# EAGLE design pic24OLED (EAGLE 9.4.2)
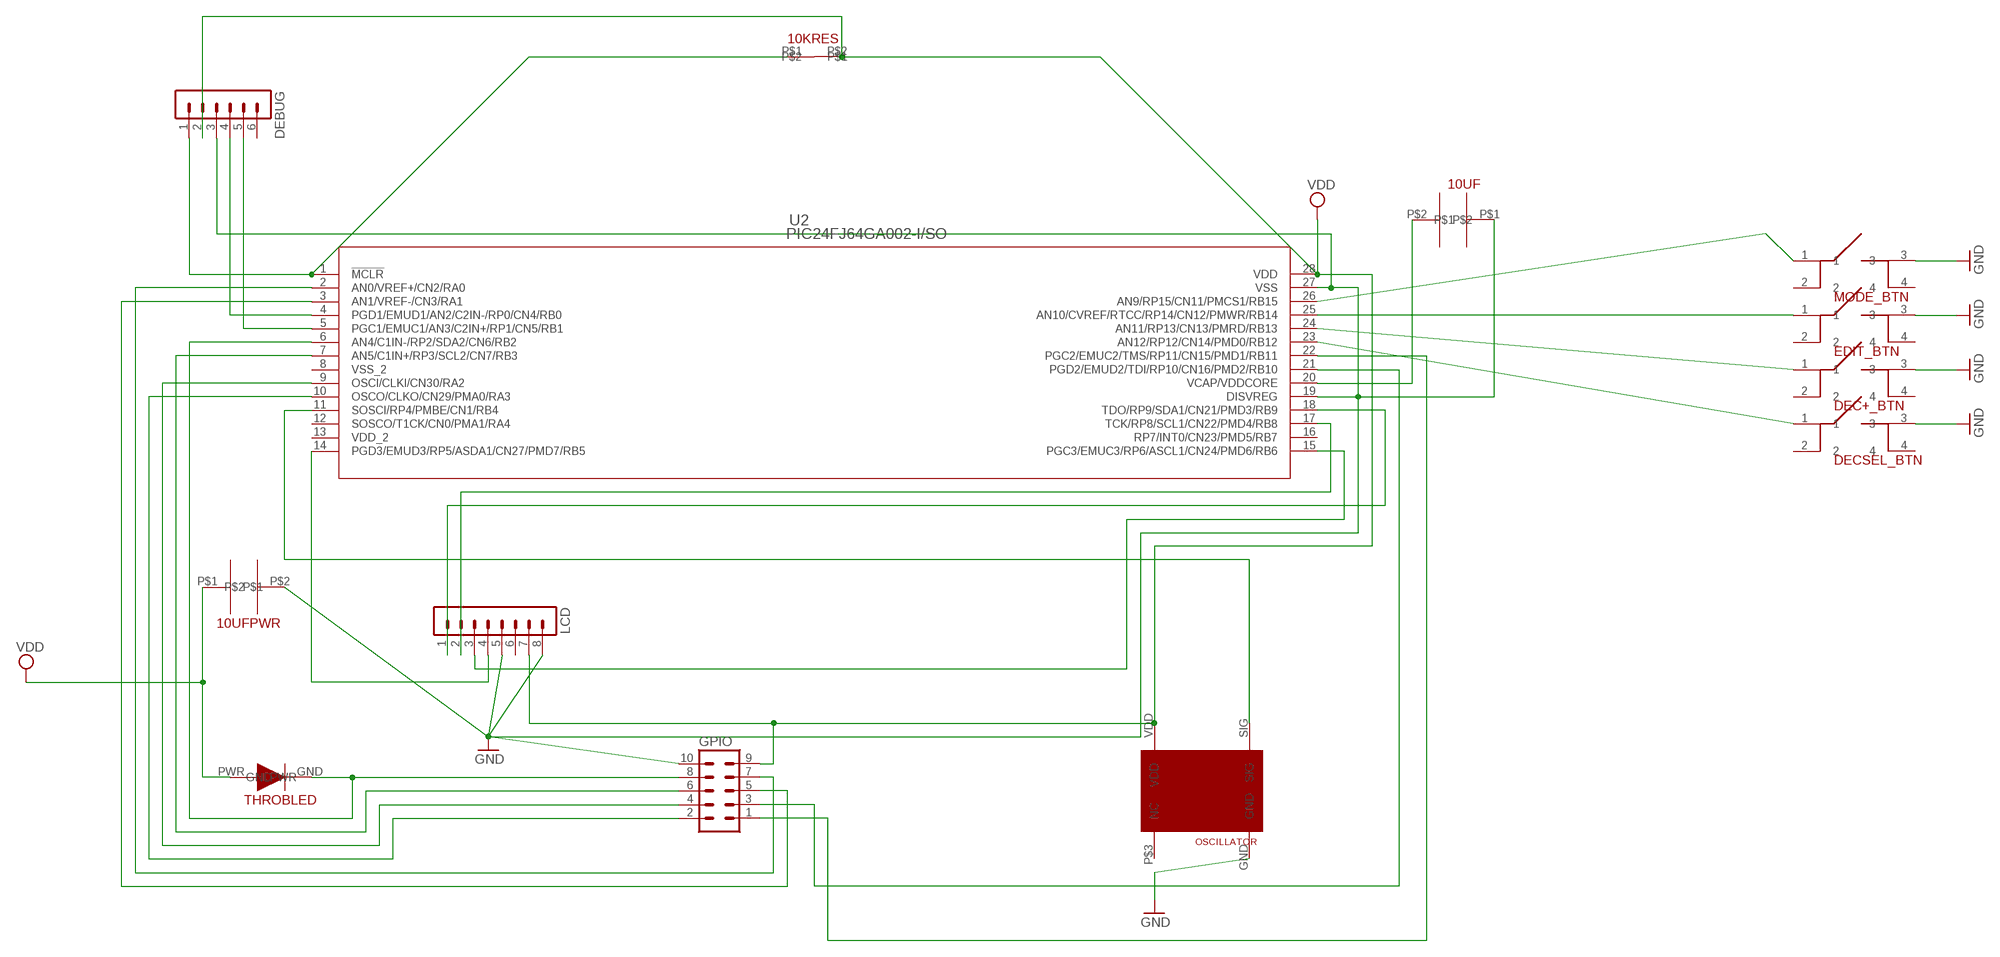
[diagram p0: schematic, sheet 1]

## Parts
10KRES  THRESISTOR  [THRESISTOR]
10UF  THCAP  [THCAP]
10UFPWR  THCAP  [THCAP]
DEBUG  MA06-1  [MA06-1]
DEC+_BTN  PTS645-BUTTONPTS645  [TL3315-BUTTON]
DECSEL_BTN  PTS645-BUTTONPTS645  [TL3315-BUTTON]
EDIT_BTN  PTS645-BUTTONPTS645  [TL3315-BUTTON]
GPIO  MA05-2  [MA05-2]
LCD  MA08-1  [MA08-1]
MODE_BTN  PTS645-BUTTONPTS645  [TL3315-BUTTON]
OSCILLATOR  LX0-32.768OSCILLATOR  [LX0-32.768OSCILLATOR]
THROBLED  THLED  [THLED]
U2  PIC24FJ64GA002-I/SO  [SOIC28-W_MC]

## Nets
GND: 10UF.P$1 10UFPWR.P$2 DEBUG.3 DEC+_BTN.3 DECSEL_BTN.3 EDIT_BTN.3 GPIO.10 LCD.5 LCD.8 MODE_BTN.3 OSCILLATOR.GND U2.19(DISVREG) U2.27(VSS)
N$1: 10KRES.P$1 DEBUG.1 U2.1(!MCLR)
N$2: GPIO.4 U2.9(OSCI/CLKI/CN30/RA2)
N$3: MODE_BTN.1 U2.26(AN9/RP15/CN11/PMCS1/RB15)
N$4: EDIT_BTN.1 U2.25(AN10/CVREF/RTCC/RP14/CN12/PMWR/RB14)
N$5: DEC+_BTN.1 U2.24(AN11/RP13/CN13/PMRD/RB13)
N$6: DECSEL_BTN.1 U2.23(AN12/RP12/CN14/PMD0/RB12)
N$7: LCD.4 U2.14(PGD3/EMUD3/RP5/ASDA1/CN27/PMD7/RB5)
N$8: LCD.3 U2.15(PGC3/EMUC3/RP6/ASCL1/CN24/PMD6/RB6)
N$9: LCD.2 U2.17(TCK/RP8/SCL1/CN22/PMD4/RB8)
N$10: LCD.1 U2.18(TDO/RP9/SDA1/CN21/PMD3/RB9)
N$11: 10UF.P$2 U2.20(VCAP/VDDCORE)
N$12: GPIO.6 U2.7(AN5/C1IN+/RP3/SCL2/CN7/RB3)
N$13: OSCILLATOR.SIG U2.11(SOSCI/RP4/PMBE/CN1/RB4)
N$14: GPIO.8 THROBLED.GND U2.6(AN4/C1IN-/RP2/SDA2/CN6/RB2)
N$15: DEBUG.4 U2.4(PGD1/EMUD1/AN2/C2IN-/RP0/CN4/RB0)
N$16: DEBUG.5 U2.5(PGC1/EMUC1/AN3/C2IN+/RP1/CN5/RB1)
N$17: GPIO.2 U2.10(OSCO/CLKO/CN29/PMA0/RA3)
N$18: GPIO.7 U2.2(AN0/VREF+/CN2/RA0)
N$19: GPIO.5 U2.3(AN1/VREF-/CN3/RA1)
N$20: GPIO.3 U2.21(PGD2/EMUD2/TDI/RP10/CN16/PMD2/RB10)
N$21: GPIO.1 U2.22(PGC2/EMUC2/TMS/RP11/CN15/PMD1/RB11)
VDD: 10KRES.P$2 10UFPWR.P$1 DEBUG.2 GPIO.9 LCD.7 OSCILLATOR.VDD THROBLED.PWR U2.28(VDD)
Unconnected: DEBUG.6 DEC+_BTN.2 DEC+_BTN.4 DECSEL_BTN.2 DECSEL_BTN.4 EDIT_BTN.2 EDIT_BTN.4 LCD.6 MODE_BTN.2 MODE_BTN.4 OSCILLATOR.P$3(NC) U2.8(VSS_2) U2.12(SOSCO/T1CK/CN0/PMA1/RA4) U2.13(VDD_2) U2.16(RP7/INT0/CN23/PMD5/RB7)

## Library data of the parts
10KRES = pic24fj64ga002:THRESISTOR
10UF 10UFPWR = pic24fj64ga002:THCAP
DEBUG = con-lstb:MA06-1: PIN HEADER; OC_FARNELL: unknown; OC_NEWARK: unknown
DEC+_BTN DECSEL_BTN EDIT_BTN MODE_BTN = pic24fj64ga002:PTS645-BUTTON
GPIO = con-lstb:MA05-2: PIN HEADER; OC_FARNELL: unknown; OC_NEWARK: unknown
LCD = pic24fj64ga002:MA08-1: PIN HEADER; OC_FARNELL: unknown; OC_NEWARK: unknown
OSCILLATOR = pic24fj64ga002:LX0-32.768OSCILLATOR
THROBLED = pic24fj64ga002:THLED
U2 = pic24fj64ga002:PIC24FJ64GA002-I/SO; MANUFACTURER_PART_NUMBER: PIC24FJ64GA002ISO; VENDOR: Microchip

## Board
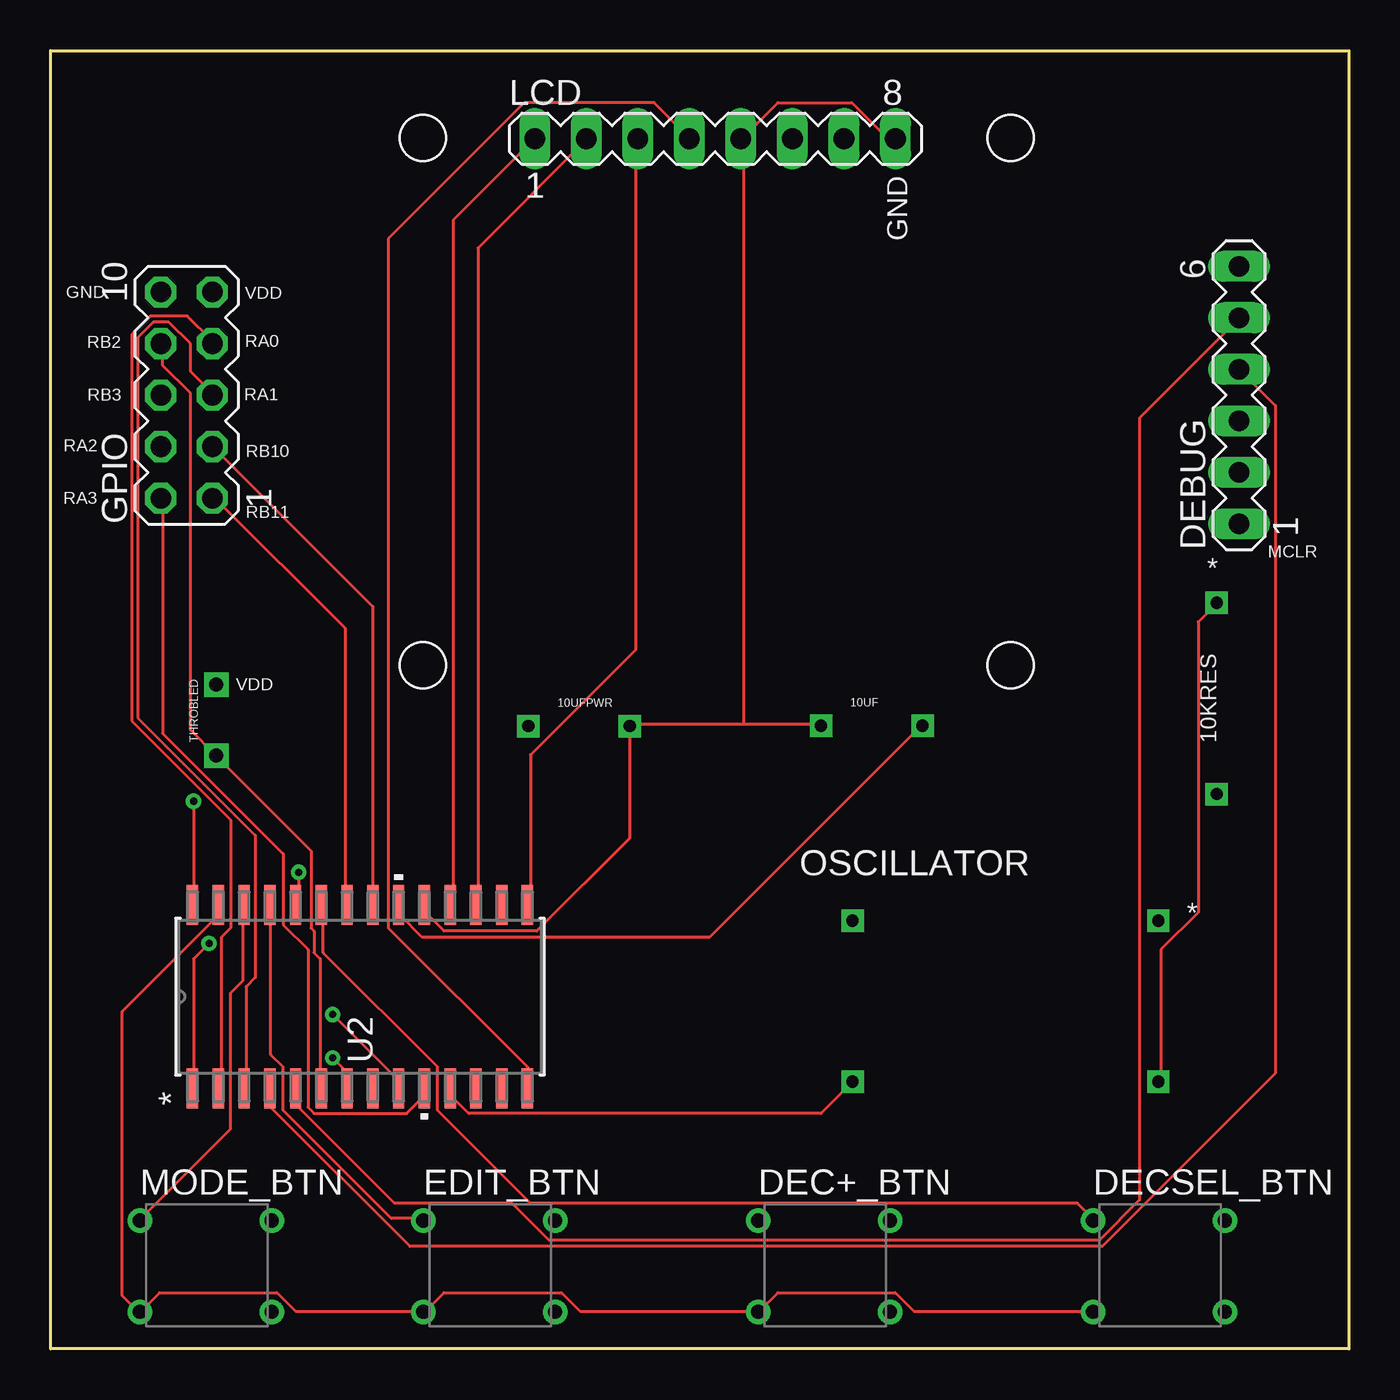
[diagram p1: board, top side]
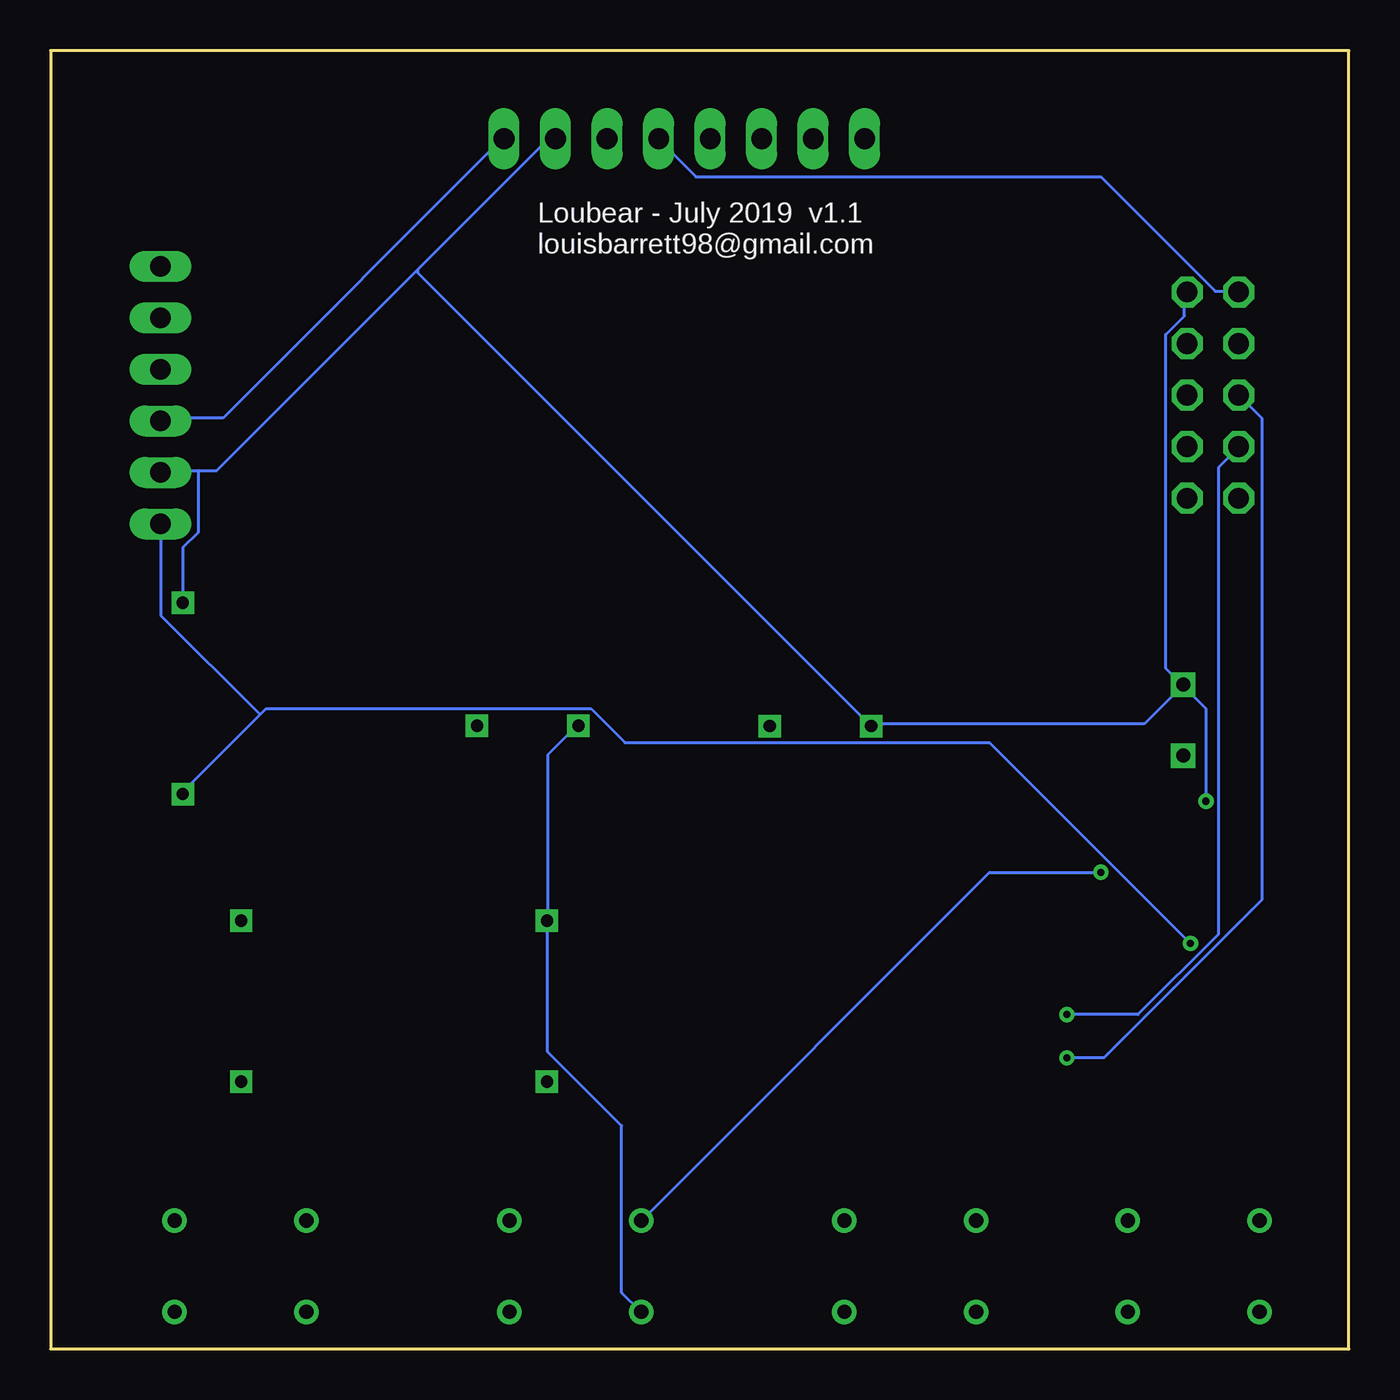
[diagram p2: board, bottom side, seen from below]

Size 64 x 64 mm. Coordinates in mm from the lower left corner, seen from the top.
Outline: 0,0 0,64 64,64 64,0 0,0
Copper layers (1*16): Top 0.035mm / dielectric 1.5mm / Bottom 0.035mm
Design rules "default": minimum track width 6mil, minimum drill 0.35mm, track to track 6mil, track to pad 6mil, pad to pad 6mil, via to via 6mil, smd to smd 6mil, copper to edge 40mil, drill to drill 6mil, minimum pad ring 10mil, minimum via ring 8mil, stop-mask expansion 4mil, vias tented up to drill 0mil, thermal gap 10mil

### Footprints (pad centres in the part's own frame; a part is rotated, then mirrored left to right if it is on the bottom)
THRESISTOR = drill 0.6 square: P$1 0,0; P$2 9.43,0
THCAP = drill 0.6 square: P$1 0,0; P$2 5,0
MA06-1 = drill 1.016 long: 1 -6.35,0; 2 -3.81,0; 3 -1.27,0; 4 1.27,0; 5 3.81,0; 6 6.35,0
TL3315-BUTTON = drill 0.7: 1 0,0; 2 6.5,0; 3 0,-4.5; 4 6.5,-4.5
MA05-2 = drill 1.016 octagon: 1 -5.08,-1.27; 2 -5.08,1.27; 3 -2.54,-1.27; 4 -2.54,1.27; 5 0,-1.27; 6 0,1.27; 7 2.54,-1.27; 8 2.54,1.27; 9 5.08,-1.27; 10 5.08,1.27
MA08-1 = drill 1.016 long: 1 -8.89,0; 2 -6.35,0; 3 -3.81,0; 4 -1.27,0; 5 1.27,0; 6 3.81,0; 7 6.35,0; 8 8.89,0
LX0-32.768OSCILLATOR = drill 0.6 square: GND 15.08,-7.94; P$3 0,-7.94; SIG 15.08,0; VDD 0,0
THLED = drill 0.7 square: GND 0,0; PWR 3.5,0
SOIC28-W_MC = smd 1.981 x 0.559: 1 -4.521,8.255; 2 -4.521,6.985; 3 -4.521,5.715; 4 -4.521,4.445; 5 -4.521,3.175; 6 -4.521,1.905; 7 -4.521,0.635; 8 -4.521,-0.635; 9 -4.521,-1.905; 10 -4.521,-3.175; 11 -4.521,-4.445; 12 -4.521,-5.715; 13 -4.521,-6.985; 14 -4.521,-8.255; 15 4.521,-8.255; 16 4.521,-6.985; 17 4.521,-5.715; 18 4.521,-4.445; 19 4.521,-3.175; 20 4.521,-1.905; 21 4.521,-0.635; 22 4.521,0.635; 23 4.521,1.905; 24 4.521,3.175; 25 4.521,4.445; 26 4.521,5.715; 27 4.521,6.985; 28 4.521,8.255

### Placement (x,y rotation side)
10KRES  57.49,27.35 90 top
10UF  37.98,30.72 0 top
10UFPWR  23.55,30.7 0 top
DEBUG  58.59,47.02 90 top
DEC+_BTN  34.88,6.32 0 top
DECSEL_BTN  51.39,6.32 0 top
EDIT_BTN  18.37,6.32 0 top
GPIO  6.7,47.02 90 top
LCD  32.76,59.66 0 top
MODE_BTN  4.4,6.32 0 top
OSCILLATOR  54.61,13.17 180 top
THROBLED  8.16,29.25 90 top
U2  15.25,17.36 90 top

### Tracks (layer width: path | path; a pad name or v marks a point on that pad's centre or on a via)
GND
  Top 0.152: LCD.8 41.64,59.76 41.18,59.76 39.5,61.44 35.84,61.44 34.17,59.76 LCD.5 34.17,59.61 34.17,30.81 | U2.19 18.47,21.81 18.47,21.51 19.39,20.59 23.96,20.59 28.53,25.17 28.53,30.65 10UFPWR.P$2 28.68,30.81 34.17,30.81 | 34.17,30.81 37.98,30.81 10UF.P$1 | U2.27 8.26,21.81 8.26,21.36 3.54,16.63 3.54,2.61 4.3,1.85 MODE_BTN.3 4.45,1.85 5.36,2.76 11.16,2.76 12.07,1.85 18.32,1.85 EDIT_BTN.3 18.47,1.85 19.39,2.76 25.18,2.76 26.09,1.85 34.78,1.85 DEC+_BTN.3 34.93,1.85 35.84,2.76 41.64,2.76 42.55,1.85 51.39,1.85 DECSEL_BTN.3
  Bottom 0.152: GPIO.10 5.52,52.14 6.58,52.14 12.22,57.78 32.19,57.78 34.02,59.61 LCD.5 | DEBUG.3 58.55,45.89 55.5,45.89 41.79,59.61 LCD.8 | 10UF.P$1 38.13,30.65 39.5,29.28 39.5,21.2 OSCILLATOR.GND 39.5,21.05 39.5,14.65 35.84,10.99 35.84,2.76 34.93,1.85 DEC+_BTN.3
N$1  (via drill 0.35)
  Top 0.152: v7.8,19.98 7.04,19.22 7.04,12.98 U2.1
  Bottom 0.152: v7.8,19.98 17.71,29.89 35.69,29.89 37.37,31.57 53.37,31.57 53.68,31.26 | 53.68,31.26 57.49,27.45 10KRES.P$1 | 53.68,31.26 58.55,36.14 58.55,40.56 DEBUG.1
N$2  (via drill 0.35)
  Top 0.152: v13.9,16.48 17.1,13.28 17.1,12.98 U2.9
  Bottom 0.152: v13.9,16.48 10.39,16.48 6.43,20.44 6.43,43.45 5.52,44.37 GPIO.4
N$3
  Top 0.152: U2.26 9.48,21.81 9.48,18.16 8.87,17.55 8.87,10.84 4.45,6.42 MODE_BTN.1
N$4
  Top 0.152: U2.25 10.85,21.81 10.85,14.5 11.46,13.89 11.46,11.76 16.8,6.42 18.32,6.42 EDIT_BTN.1
N$5  (via drill 0.35)
  Top 0.152: v12.22,23.49 12.22,21.97 U2.24
  Bottom 0.152: v12.22,23.49 17.71,23.49 DEC+_BTN.1
N$6
  Top 0.152: U2.23 13.44,21.81 13.44,19.53 19.08,13.89 19.08,11.76 23.65,7.18 50.63,7.18 51.39,6.42 DECSEL_BTN.1
N$7
  Top 0.152: U2.14 23.5,12.98 23.5,13.89 16.64,20.75 16.64,54.73 23.35,61.44 29.75,61.44 31.43,59.76 LCD.4
N$8
  Top 0.152: U2.15 23.65,21.97 23.65,29.28 28.84,34.46 28.84,59.61 LCD.3
N$9
  Top 0.152: U2.17 21.06,21.97 21.06,54.28 26.4,59.61 LCD.2
N$10
  Top 0.152: U2.18 19.84,21.97 19.84,55.65 23.81,59.61 LCD.1
N$11
  Top 0.152: U2.20 17.25,21.81 17.25,21.36 18.32,20.29 32.49,20.29 42.86,30.65 10UF.P$2
N$12  (via drill 0.35)
  Top 0.152: v13.9,14.35 14.51,13.74 14.51,12.98 U2.7
  Bottom 0.152: v13.9,14.35 12.07,14.35 4.3,22.12 4.3,45.89 5.36,46.96 GPIO.6
N$13
  Top 0.152: U2.11 19.84,12.82 19.84,12.36 20.6,11.6 37.98,11.6 39.5,13.13 OSCILLATOR.SIG
N$14
  Top 0.152: U2.6 13.29,12.98 13.29,19.22 12.98,19.53 12.98,20.59 12.83,20.75 12.83,24.56 8.26,29.13 THROBLED.GND 8.11,29.28 6.89,30.5 6.89,47.11 5.52,48.48 5.52,49.55 GPIO.8
N$15
  Top 0.152: U2.4 10.85,12.82 10.85,11.91 17.71,5.05 51.85,5.05 60.38,13.58 60.38,46.5 58.7,48.18 DEBUG.4
N$16
  Top 0.152: U2.5 12.22,12.82 12.22,11.91 16.95,7.18 22.74,7.18 24.57,5.36 51.69,5.36 53.68,7.34 53.68,45.89 58.55,50.77 DEBUG.5
N$17
  Top 0.152: U2.10 18.32,12.82 18.32,12.36 17.56,11.6 12.98,11.6 12.68,11.91 12.68,19.68 11.46,20.9 11.46,24.41 5.52,30.35 5.52,41.93 GPIO.2
N$18
  Top 0.152: U2.2 8.41,12.98 8.41,20.29 8.87,20.75 8.87,26.08 3.99,30.96 3.99,50.01 4.91,50.92 6.74,50.92 7.96,49.7 GPIO.7
N$19
  Top 0.152: U2.3 9.63,12.98 9.63,17.85 10.09,18.31 10.09,25.32 4.3,31.11 4.3,49.86 5.06,50.62 5.82,50.62 6.89,49.55 6.89,48.18 7.96,47.11 GPIO.5
N$20
  Top 0.152: U2.21 15.88,21.97 15.88,36.6 8.11,44.37 GPIO.3
N$21
  Top 0.152: U2.22 14.51,21.97 14.51,35.53 8.11,41.93 GPIO.1
VDD  (via drill 0.35)
  Top 0.152: v7.04,27 7.04,21.97 U2.28 | OSCILLATOR.VDD 54.74,13.28 54.74,19.68 56.57,21.51 56.57,35.84 57.49,36.75 10KRES.P$2
  Bottom 0.152: v7.04,27 7.04,31.57 8.11,32.63 THROBLED.PWR | THROBLED.PWR 8.26,32.63 10.09,30.81 23.5,30.81 10UFPWR.P$1 23.65,30.81 45.9,53.06 45.9,53.21 | GPIO.9 8.11,51.99 8.11,50.92 9.02,50.01 9.02,33.55 8.26,32.79 THROBLED.PWR | 45.9,53.21 55.81,43.3 56.72,43.3 | 45.9,53.21 39.5,59.61 39.2,59.61 LCD.7 | 56.72,43.3 58.55,43.3 DEBUG.2 | 56.72,43.3 56.72,40.25 57.49,39.49 57.49,36.9 10KRES.P$2

### Text on the board
bPlace: Loubear - July 2019 v1.1 / louisbarrett98@gmail.com
tNames: GND | GND | VDD | RB2 | RA0 | RB3 | RA1 | RA2 | RB10 | RA3 | RB11 | MCLR | * | VDD | *